# Altium schematic sheet Humidifier_Schematic.SchDoc
size B; SheetNumber: 1; SheetTotal: 1
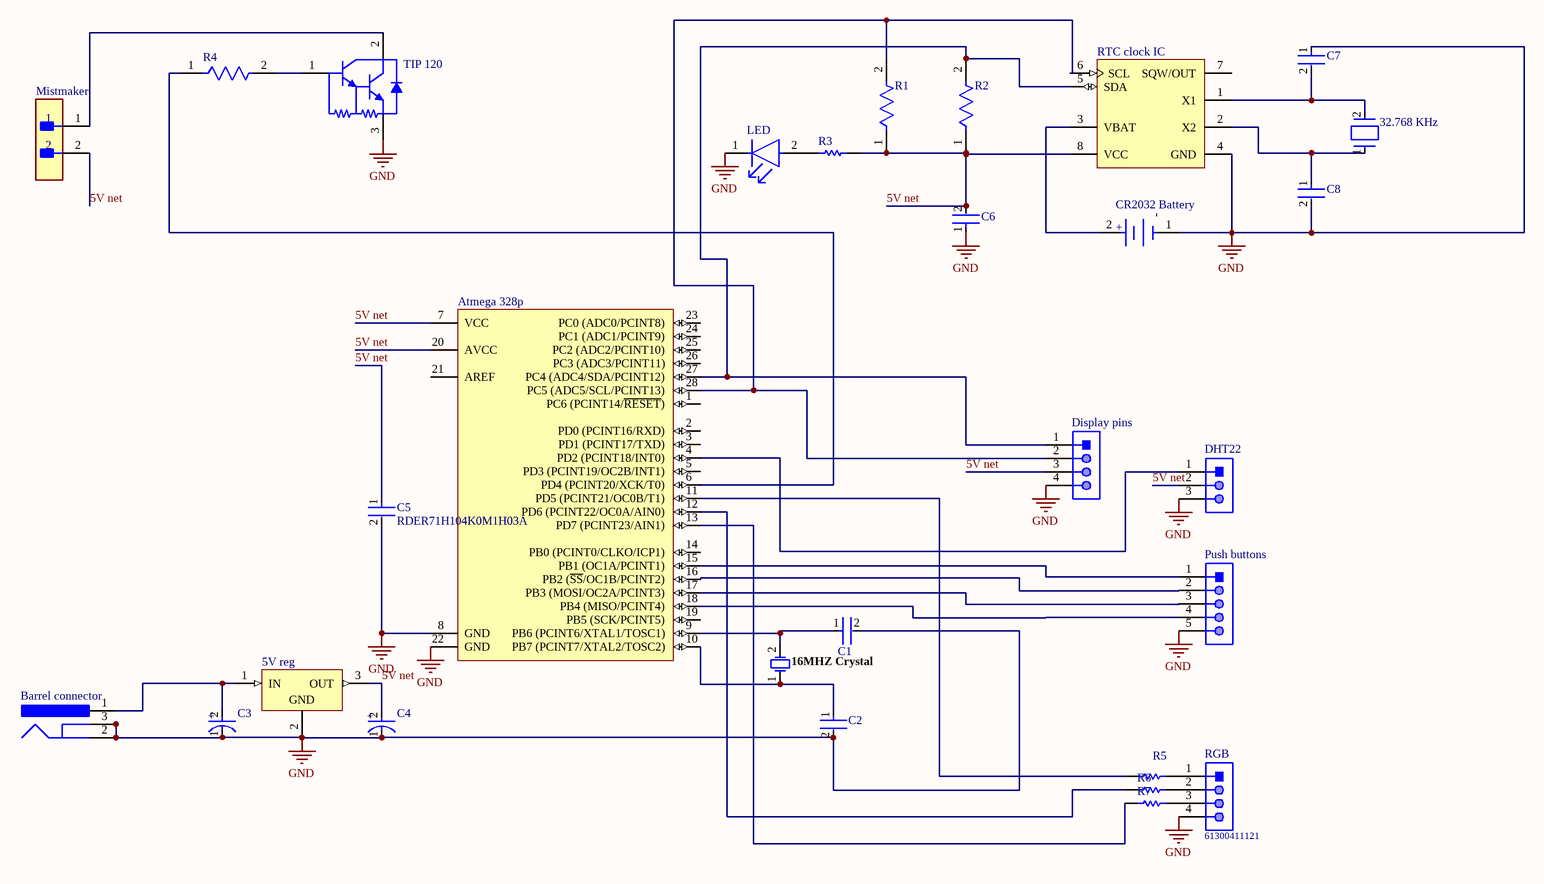
[diagram p0: Humidifier_Schematic.SchDoc]

## Parts
5V_reg  LM7805CT  [FAIR-TO-220-3]  (value not drawn)
16MHZ_Crystal  FOXSLF/160-20  [FOX-FOXSLF160-20]  (value not drawn)
32.768_KHz  AB26TRB-32.768KHZ-T  [FP-AB26TRB-MFG]  (value not drawn)
Atmega_328p  ATmega328-PU  [28P3]  (value not drawn)
Barrel_connector  PJ-002A  [CUI-PJ-002A_V]  (value not drawn)
C1  RCE5C1H220J0K1H03B  [FP-RCE0K1-MFG]  (value not drawn)
C2  RCE5C1H220J0K1H03B  [FP-RCE0K1-MFG]  (value not drawn)
C3  EEUFR1A472L  [FP-RAD-TH-D_12_5_0_5-L_30-MFG]  (value not drawn)
C4  EEUFR1A472L  [FP-RAD-TH-D_12_5_0_5-L_30-MFG]  (value not drawn)
C5  RDER71H104K0M1H03A  [FP-RDE0M1-MFG]
C6  RCER71H104K0K1H03B  [FP-RCE0K1-MFG]  (value not drawn)
C7  RCE5C1H120J0DBH03A  [FP-RCE0DB-MFG]  (value not drawn)
C8  RCE5C1H120J0DBH03A  [FP-RCE0DB-MFG]  (value not drawn)
CR2032_Battery  BU2032SM-HD-G  [FP-BU2032SM-HD-G-MFG]  (value not drawn)
DHT22  61300311121  [61300311121]  (value not drawn)
Display_pins  61300411121  [61300411121]  (value not drawn)
LED  HLMP-1503  [FP-HLMP-1503-MFG]  (value not drawn)
Mistmaker  M20-9990246  [FP-M20-9990246-MFG]  (value not drawn)
Push_buttons  61300511121  [61300511121]  (value not drawn)
R1  CF18JT2K20  [FP-CF18-MFG]  (value not drawn)
R2  CF18JT2K20  [FP-CF18-MFG]  (value not drawn)
R3  MFR-25FBF52-1K  [RESA60-630X240]  (value not drawn)
R4  CF18JT2K20  [FP-CF18-MFG]  (value not drawn)
R5  MFR-25FBF52-1K  [RESA60-630X240]  (value not drawn)
R6  MFR-25FBF52-1K  [RESA60-630X240]  (value not drawn)
R7  MFR-25FBF52-1K  [RESA60-630X240]  (value not drawn)
RGB  61300411121  [61300411121]
RTC_clock_IC  DS1307+  [P8+2]  (value not drawn)
TIP_120  TIP120G  [ONSC-TO-220-3-221A-09]  (value not drawn)

## Nets
GND: 5V_reg.2(GND) Atmega_328p.8(GND) Atmega_328p.22(GND) Barrel_connector.2 Barrel_connector.3 C1.2 C2.2 C3.1(C) C4.1(C) C5.2 C6.1 C7.1 C8.2 CR2032_Battery.1(C) DHT22.3 Display_pins.4 LED.1(C) Push_buttons.5 RGB.4 RTC_clock_IC.4(GND) TIP_120.3(E)
5V net: 5V_reg.3(OUT) Atmega_328p.7(VCC) Atmega_328p.20(AVCC) C4.2(A) C5.1 C6.2 DHT22.2 Display_pins.3 Mistmaker.2 R1.1 R2.1 R3.2 RTC_clock_IC.8(VCC)
Net5V_reg_1: 5V_reg.1(IN) Barrel_connector.1 C3.2(A)
Net16MHZ_Crystal_1: 16MHZ_Crystal.1 Atmega_328p.10(PB7_(PCINT7/XTAL2/TOSC2)) C2.1
Net16MHZ_Crystal_2: 16MHZ_Crystal.2 Atmega_328p.9(PB6_(PCINT6/XTAL1/TOSC1)) C1.1
Net32.768_KHz_1: 32.768_KHz.1 C8.1 RTC_clock_IC.2(X2)
Net32.768_KHz_2: 32.768_KHz.2 C7.2 RTC_clock_IC.1(X1)
NetAtmega_328p_4: Atmega_328p.4(PD2_(PCINT18/INT0)) DHT22.1
NetAtmega_328p_6: Atmega_328p.6(PD4_(PCINT20/XCK/T0)) R4.1
NetAtmega_328p_11: Atmega_328p.11(PD5_(PCINT21/OC0B/T1)) R5.1
NetAtmega_328p_12: Atmega_328p.12(PD6_(PCINT22/OC0A/AIN0)) R6.1
NetAtmega_328p_13: Atmega_328p.13(PD7_(PCINT23/AIN1)) R7.1
NetAtmega_328p_15: Atmega_328p.15(PB1_(OC1A/PCINT1)) Push_buttons.1
NetAtmega_328p_16: Atmega_328p.16(PB2_(~{SS}/OC1B/PCINT2)) Push_buttons.2
NetAtmega_328p_17: Atmega_328p.17(PB3_(MOSI/OC2A/PCINT3)) Push_buttons.3
NetAtmega_328p_18: Atmega_328p.18(PB4_(MISO/PCINT4)) Push_buttons.4
NetAtmega_328p_27: Atmega_328p.27(PC4_(ADC4/SDA/PCINT12)) Display_pins.1 R2.2 RTC_clock_IC.5(SDA)
NetAtmega_328p_28: Atmega_328p.28(PC5_(ADC5/SCL/PCINT13)) Display_pins.2 R1.2 RTC_clock_IC.6(SCL)
NetCR2032_Battery_2: CR2032_Battery.2(A) RTC_clock_IC.3(VBAT)
NetLED_2: LED.2(A) R3.1
NetMistmaker_1: Mistmaker.1 TIP_120.2(C)
NetR4_2: R4.2 TIP_120.1(B)
NetR5_2: R5.2 RGB.1
NetR6_2: R6.2 RGB.2
NetR7_2: R7.2 RGB.3

Not connected (* = marked no-connect by the designer): Atmega_328p 1(PC6_(PCINT14/~{RESET})) 2(PD0_(PCINT16/RXD)) 3(PD1_(PCINT17/TXD)) 5(PD3_(PCINT19/OC2B/INT1)) 14(PB0_(PCINT0/CLKO/ICP1)) 19(PB5_(SCK/PCINT5)) 21(AREF) 23(PC0_(ADC0/PCINT8)) 24(PC1_(ADC1/PCINT9)) 25(PC2_(ADC2/PCINT10)) 26(PC3_(ADC3/PCINT11)); RTC_clock_IC 7(SQW/OUT)

## Notes on the sheet
- (in symbol CMP-05427-001008-1) +
- (in symbol CMP-136216-000005-1) -; +

## Library data of the parts
5V_reg = CMP-2000-04938-1: Positive Voltage Regulator, 5 V, 1 A, -40 to 125 degC, 3-Pin TO-220, RoHS, Tube; Manufacturer: FairchildSemiconductor; Maximum Input Voltage: 35V; Maximum Quiescent Current: 8mA; Load Regulation: 100mV; Maximum Output Current: 2.2(Typ)A; Output Type: Fixed; Typical Dropout Voltage @ Current: 2@1AV; Rad Hard: No; Output Voltage: 5V; Accuracy: ±4%; Number of Outputs: 1; Category: LinearRegulator; Package Description: 3-Pin Through Hole Device, Body 10 x 4.5 mm, Pitch 2.54 mm; Packaging: Rail/Tube; Mounting: ThroughHole; Polarity: Positive; Manufacturer URL: https://www.fairchildsemi.com/; Line Regulation: 100mV; Datasheet Version: Aug-12; Datasheet URL: https://datasheet.ciiva.com/26904/lm7805ct-26904988.pdf; Package Reference: TO-220; Package URL: https://www.fairchildsemi.com/package-drawings/TO/TO220B03.pdf; Package: 3TO-220AB; Operating Temperature: -40to125degC; Type: Linear
16MHZ_Crystal = CMP-1749-00003-1: Resistance Weld Thru-Hole Crystal, 16 MHz, -20 to 70 degC, 2-Pin THD, RoHS, Bulk; Voltage Rating: 250 V; Tolerance: 1%; Resistance: 221 kohm; Case\Package: Axial; Power Rating: 250 mW; RoHSCompliant: true; Package Quantity: 200; Packaging: Bulk; Min Operating Temperature: -55 degC; DatasheetVersion: Mar-15; ComponentLink1URL: http://www.foxonline.com/; Max Operating Temperature: 155 degC; PackageReference: FOXSLF160-20; Mount: Through Hole; PackageDescription: 2-Pin Through Hole Device, Body 11.35 x 4.65 mm; ComponentLink1Description: Manufacturer URL; ComponentLink2URL: http://www.foxonline.com/pdfs/hc49slf.pdf; ComponentLink2Description: Datasheet; Length: 0.248 inch
32.768_KHz = CMP-27762-006068-1: CRYSTAL 32.7680KHZ 12.5PF TH; Frequency Stability: -0.034ppm; Frequency Tolerance: 20ppm; Series Resistance: 50kR; Case/Package: Radial; Package Quantity: 500; Packaging: Tape and Reel; Lead Pitch: 2.54mm; Termination: Radial; Mount: Surface Mount; Frequency: 32.768kHz; Min Operating Temperature: -40°C; REACH SVHC: No SVHC; Load Capacitance: 12.5pF; Lead Free: Lead Free; Operating Frequency: 32.768 kHz; Max Operating Temperature: 85°C; Length: 6mm; Height: 0.075inch; Depth: 1.9mm; Tolerance: 20ppm; ESR (Equivalent Series Resistance): 50kR; Number of Pins: 2; Series: AB26TRB
Atmega_328p = CMP-0095-00015-2: 8-bit AVR Microcontroller, 32KB Flash, 1KB EEPROM, 2KB SRAM, 28-pin PDIP, Industrial Grade (-40°C to 85°C); ComponentLink3Description: ATmega48A/48PA/88A/88PA/168A/168PA/328/328P Summary; RevisionNote: DatasheetVersion updated. URLs added.; DatasheetVersion: revD, May-2011; ComponentLink1URL: http://www.atmel.com/; PackageVersion: revB, Sep-2001; PackageDescription: 28-lead (0.300"/7.62mm Wide) Plastic Dual Inline Package (PDIP); PackageReference: 28P3; ComponentLink1Description: Manufacturer URL; ComponentLink2Description: ATmega48A/48PA/88A/88PA/168A/168PA/328/328P Datasheet; ComponentLink3URL: http://www.atmel.com/dyn/resources/prod_documents/8271S.pdf; ComponentLink2URL: http://www.atmel.com/dyn/resources/prod_documents/8271.pdf
Barrel_connector = CMP-2000-06895-2: Through Hole Right Angle DC Power Jack, 2.5 A, 2 mm Center Pin, 3 Position, -25 to 85 degC, RoHS, Bulk; Manufacturer: CUIInc.; Brand: CUI; Inside Contact Diameter: 2mm; Voltage Rating: 24V; Outside Contact Diameter: 6.5mm; Current Rating: 2.5A; Insulation Resistance: 50MOhms; Contact Gender: Male; Connector Type: DCPowerJack; Datasheet Version: Rev. 1.03, 04/2016; Housing Material: PolybutyleneTerephthalate(PBT); Operating Temperature Range: -25Cto+85C; Termination Style: ThroughHole; Product Category: DCPowerConnectors; Mounting Technology: ThroughHole; Mounting Style: ThroughHole; Factory Pack Quantity: 500; Contact Plating: Nickel; Package Reference: PJ-002A; Mounting Angle: Right; Package Description: 3-Pin Through Hole Device, Body 14.4 x 9 mm, Height 11 mm; Flammability Rating: UL94V-0; Manufacturer URL: http://www.cui.com/; Product: Jacks; Contact Material: Copper; Datasheet URL: http://www.cui.com/product/resource/pj-002a.pdf; RoHS: True
C1 C2 = CMP-06035-047580-1: Cap Ceramic 22pF 50V C0G ±5% Radial 5mm +125°C Automotive Bulk; Lead/Base Style: Formed Leads; Lead Diameter: 0.5mm; Tolerance: 5%; Dielectric: C0G; Case/Package: Radial; Min Operating Temperature: -55°C; Height: 3.5mm; Length: 0.142inch; Height - Seated (Max): 0.138inch; Lead Pitch: 0.197inch; Resistor Type: Ceramic; Max Operating Temperature: 125°C; Package Quantity: 500; Capacitance: 22pF; Mount: Through Hole; Ratings: AEC-Q200; Termination: Radial; Voltage Rating: 50V; Width: 0.098inch; Voltage Rating (DC): 50V; Packaging: Bulk
C3 C4 = CMP-05427-001008-1: Aluminum Electrolytic Capacitors (Radial Lead Type) 4700uF ±20% 10V; Life (Hours): 10000Hour; Lead Diameter: 0.8mm; Impedance: 13mR; Dielectric Material: Aluminium; Ripple Current: 3.63A; Capacitance: 4.7mF; Lead/Base Style: Straight; Lead Pitch: 5mm; Height - Seated (Max): 1.26inch; Radiation Hardening: No; Package Quantity: 100; Diameter: 12.5mm; REACH SVHC: Yes; RoHS Compliant: Yes; Length: 30mm; Case/Package: Radial; Voltage Rating: 10V; ESR (Equivalent Series Resistance): 13mR; Termination: Radial; Max Operating Temperature: 105°C; Height: 30mm; Tolerance: 20%; Series: FR; Mount: Through Hole; Construction: RADIAL; Voltage Rating (DC): 10V; Number of Pins: 2; Min Operating Temperature: -40°C; Voltage: 10V; Packaging: Bulk; Ripple Current (AC): 3.63A
C5 = CMP-06035-051680-1: Ceramic Capacitor 100nF ±10% 50V X7R Radial; Lead/Base Style: Kinked; Lead Diameter: 0.5mm; Lead Free: Lead Free; Mount: Through Hole; Package Quantity: 2000; Lead Pitch: 0.197inch; Capacitance: 100nF; Case/Package: Radial; Tolerance: 10%; Height - Seated (Max): 0.236inch; Max Operating Temperature: 125°C; Dielectric: X7R; Min Operating Temperature: -55°C; Voltage Rating (DC): 50V; Voltage Rating: 50V; Termination: Radial; Height: 3.5mm; Resistor Type: Ceramic; Width: 3.5mm; Packaging: Tape and Reel; Length: 0.157inch
C6 = CMP-06035-058483-1: Cap Ceramic 100nF 50V X7R ±10% Radial 5mm +125°C Automotive Bulk; Lead Diameter: 0.5mm; Lead/Base Style: Formed Leads; Lead Free: Lead Free; Length: 3.6mm; Voltage: 50V; Ratings: AEC-Q200; Termination: Radial; Capacitance: 100nF; Height - Seated (Max): 0.138inch; Voltage Rating: 50V; Voltage Rating (DC): 50V; Height: 3.5mm; Min Operating Temperature: -55°C; Mount: Through Hole; Package Quantity: 500; Depth: 2.5mm; Width: 0.098inch; Lead Pitch: 0.197inch; Dielectric: X7R; Max Operating Temperature: 125°C; Case/Package: Radial; Packaging: Bulk; Tolerance: 10%; Resistor Type: Ceramic
C7 C8 = CMP-06035-009458-1: Cap Ceramic 12pF 50V C0G ±5% Radial 2.5mm +125°C Ammo Pack; Lead Diameter: 0.5mm; Lead/Base Style: Straight; Tolerance: 5%; Max Operating Temperature: 125°C; Termination: Radial; Height: 3.5mm; Width: 0.098inch; Height - Seated (Max): 0.138inch; Voltage Rating (DC): 50V; Voltage Rating: 50V; Mount: Through Hole; Package Quantity: 2000; Lead Pitch: 0.098inch; Length: 0.138inch; Dielectric: C0G; Case/Package: Radial; Capacitance: 12pF; Packaging: Tape and Reel; Ratings: AEC-Q200; Min Operating Temperature: -55°C; Resistor Type: Ceramic
CR2032_Battery = CMP-136216-000005-1: BATTERY HOLDER COIN 20MM SMD; Number of Cells: 1; Termination: SMD/SMT; Min Operating Temperature: -40°C; Case/Package: SMD/SMT; Diameter: 20mm; Package Quantity: 1; Lead Free: Lead Free; Mount: Surface Mount; Packaging: Cut Tape; Max Operating Temperature: 280°C
DHT22 = CMP-1502-01062-1: THT Vertical Pin Header WR-PHD, Pitch 2.54 mm, Single Row, 3 pins; Manufacturer: Wurth Elektronik; Withstanding Voltage: 500VAC; Working Voltage: 250VAC; Rated Current: 3A; Pitch: 2.54mm; Pin Number: 3; Gender: Male; Contact Resistance: 20mOhm; Package Reference: 61300311121; Manufacturer URL: http://www.we-online.de; Datasheet URL: https://katalog.we-online.de/em/datasheet/6130xx11121.pdf; Operating Temperature: -40to105degC; Part Number: 61300311121; Orientation: Vertical; Packaging: Bag; Row Number: Single; Mounting Technology: THT; Publisher: WurthElektronik
Display_pins RGB = CMP-1502-01064-1: THT Vertical Pin Header WR-PHD, Pitch 2.54 mm, Single Row, 4 pins; Manufacturer: Wurth Elektronik; Withstanding Voltage: 500VAC; Rated Current: 3A; Working Voltage: 250VAC; Pin Number: 4; Gender: Male; Contact Resistance: 20mOhm; Pitch: 2.54mm; Manufacturer URL: http://www.we-online.de; Operating Temperature: -40to105degC; Packaging: Bag; Mounting Technology: THT; Package Reference: 61300411121; Datasheet URL: https://katalog.we-online.de/em/datasheet/6130xx11121.pdf; Publisher: WurthElektronik; Part Number: 61300411121; Row Number: Single; Orientation: Vertical
LED = CMP-18399-000010-1: LED GREEN DIFFUSED T-1 T/H; Manufacturer: Broadcom; Reverse Voltage: 5V; Wavelength: 569nm; Forward Voltage: 2.1V; Led Orientation: Straight; Viewing Angle: 60°; Max Junction Temp: +110°C; Peak Emmision Wavelength: 565nm; Luminous Intensity: 1mcd; Standoff Height: 0.88mm; Forward Current: 10mA; Mouser Description: LED; Green; 1mcd; 0.115In.Dia.; T-1; 565nm; 25mA; 2.1V; 5V; GaP; -20degC; 100deg; ComponentLink2Description: Datasheet; Digikey Description: LED GREEN DIFFUSED T-1 T/H; Device Class L1: Optoelectronics; Device Class L3: unset; Automotive: No; Device Class L2: LEDs; Manufacturer Part Number: HLMP-1503; Category: Diode; Temperature Range Low: -20°C; Height: 6.35mm; RoHS: TRUE; Octopart: https://octopart.com/hlmp-1503-broadcom-71130371; Temperature: -20°C to +100°C; Lead Free: Yes; ComponentLink2URL: https://docs.broadcom.com/docs/AV02-1555EN; Package: HLMP-1503; Colour: Green; Temperature Range High: +100°C
Mistmaker = CMP-15831-000009-1: CONN HEADER VERT 2POS 2.54MM; Manufacturer: Harwin; Conn Gender: Male; Conn Orientation: Vertical; Number Of Contacts: 2; Current Rating: 3A; ComponentLink2URL: https://cdn.harwin.com/pdfs/M20-999.pdf; ComponentLink2Description: Datasheet; Package: M20-9990246; Temperature: -40°C to +105°C; Octopart: https://octopart.com/m20-9990246-harwin-2590635; Mouser Description: 2.54mm (0.1") Pitch SIL Vertical PC Tail Pin Header, 6.1mm mating pin height, tin, 2 contacts; Temperature Range High: +105°C; Device Class L1: Connectors; RoHS: TRUE; Automotive: No; Height: 8.99mm; Number Of Rows: 1; Contact Material: Tin,Nickel; Category: Conn; Pitch: 2.54mm; Lead Free: Yes; Digikey Description: CONN HEADER VERT 2POS 2.54MM; Manufacturer Part Number: M20-9990246; Temperature Range Low: -40°C; Device Class L3: unset; Device Class L2: Headers and Wire Housings
Push_buttons = CMP-1502-01068-1: THT Vertical Pin Header WR-PHD, Pitch 2.54 mm, Single Row, 5 pins; Manufacturer: Wurth Elektronik; Pin Number: 5; Contact Resistance: 20mOhm; Working Voltage: 250VAC; Pitch: 2.54mm; Withstanding Voltage: 500VAC; Rated Current: 3A; Gender: Male; Datasheet URL: https://katalog.we-online.de/em/datasheet/6130xx11121.pdf; Orientation: Vertical; Mounting Technology: THT; Row Number: Single; Package Reference: 61300511121; Publisher: WurthElektronik; Part Number: 61300511121; Packaging: Bag; Manufacturer URL: http://www.we-online.de; Operating Temperature: -40to105degC
R1 R2 R4 = CMP-26528-000001-1: RES 2.2K OHM 1/8W 5% CF AXIAL; Manufacturer: Stackpole Electronics Inc; Value: 2.2kΩ; Voltage Rating: 250V; Temperature Coefficient: 0/-400ppm/°C; Power Rating: 0.125W; Composition: Carbon Film; Octopart: https://octopart.com/cf18jt2k20-stackpole+electronics-19205714; Tolerance: 5%; Series: CF; Temperature Range Low: -55°C; ComponentLink2URL: https://www.seielect.com/catalog/sei-cf_cfm.pdf; Ipc Land Pattern Name: RESAD656W65L360D200; Package: CF18; Device Class L2: Resistors; Device Class L3: Through-Hole Resistors; Resistance: 2.2kΩ; Height: 2mm; Category: Res; ComponentLink2Description: Datasheet; Manufacturer Part Number: CF18JT2K20; Lead Free: Yes; Temperature Range High: +155°C; Temperature: -55°C to +155°C; RoHS: TRUE; Device Class L1: Passive Components; Digikey Description: RES 2.2K OHM 1/8W 5% CF AXIAL; Automotive: No
R3 R5-R7 = CMP-1659-00075-1: Axial Resistor, 1 KOhm, +/- 1%, 250 mW, -55 to 155 degC, 2-Pin THD, RoHS, Bulk; Voltage Rating: 250 V; Resistance: 10 kohm; Power Rating: 250 mW; ComponentLink2Description: Datasheet; RoHSCompliant: true; PackageReference: MFR-25; Case\Package: Axial; Max Operating Temperature: 155 degC; DatasheetVersion: Apr-13; Tolerance: 1%; ComponentLink1URL: http://www.yageo.com/; Length: 0.248 inch; ComponentLink2URL: http://www.yageo.com/documents/recent/Yageo%20LR_MFR_2013.pdf; Packaging: Bulk; Package Quantity: 200; PackageDescription: 2-Pin Axial Lead, Dia 2.4 mm, Body Length 6.3 mm; Min Operating Temperature: -55 degC; ComponentLink1Description: Manufacturer URL
RTC_clock_IC = CMP-0254-00152-1: 64 x 8, Serial, I2C Real-Time Clock, 5.0V, 8-Pin PDIP, 0 to 70 degC, Pb-Free; ComponentLink2URL: http://datasheets.maxim-ic.com/en/ds/DS1307.pdf; ComponentLink3URL: http://pdfserv.maxim-ic.com/package_dwgs/21-0043.PDF; ComponentLink1Description: Manufacturer URL; PackageVersion: revE, 2011; ComponentLink1URL: http://www.maxim-ic.com; PackageDescription: 8-Pin Plastic Dual-In-Line, Narrow (0.3in), Pitch 2.54 mm, PDIP(N), Pb-Free; ComponentLink2Description: Datasheet; Code_JEDEC: MS-001-AB; PackageReference: P8+2; DatasheetVersion: 10-Feb-2008; ComponentLink3Description: Package Specification
TIP_120 = CMP-1047-00134-1: Plastic Medium-Power, Complementary Silicon Transistor, 3-Pin TO-220, Pb-Free, Tube; Manufacturer: On Semiconductor; Polarity: NPN; IC Continuous (A): 5; PackageDescription: 3-Pin Flange Mount, Vertical Straight Lead, Body 9.97 x 4.445 mm, Pitch 2.54 mm; PackageVersion: Rev. AG, 09/2011; ComponentLink2Description: Datasheet; DatasheetVersion: Rev. 8; Mounting Technology: Through Hole; ComponentLink1URL: http://www.onsemi.com/; RoHS: TRUE; ComponentLink3URL: http://www.onsemi.com/pub_link/Collateral/221A-09.PDF; ComponentLink3Description: Package Specification; ComponentLink1Description: Manufacturer URL; Packing: Tube; PackageReference: TO-220-3-221A-09; ComponentLink2URL: http://www.onsemi.cn/pub_link/Collateral/TIP120-D.PDF; PartNumber: TIP120G